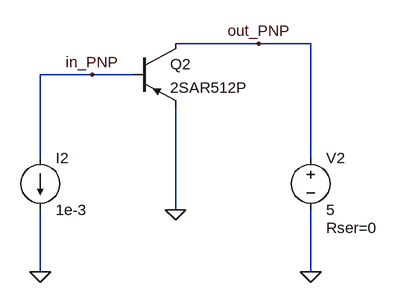
[diagram p0: schematic priklad1.1.asc]
priklad1.1.asc, the LTspice schematic file:
Version 4
SHEET 1 880 680
WIRE 240 -32 112 -32
WIRE 320 -32 240 -32
WIRE -16 16 -96 16
WIRE 48 16 -16 16
WIRE -96 144 -96 16
WIRE 320 144 320 -32
WIRE 112 224 112 64
WIRE -96 320 -96 224
WIRE 320 320 320 224
FLAG -96 320 0
FLAG 112 224 0
FLAG 320 320 0
FLAG -16 16 in_PNP
FLAG 240 -32 out_PNP
SYMBOL current -96 144 R0
WINDOW 123 0 0 Left 2
WINDOW 39 0 0 Left 2
SYMATTR InstName I2
SYMATTR Value 1e-3
SYMBOL pnp 48 -32 R0
SYMATTR InstName Q2
SYMATTR Value 2SAR512P
SYMBOL voltage 320 128 R0
WINDOW 123 0 0 Left 2
WINDOW 39 24 124 Left 2
SYMATTR InstName V2
SYMATTR Value 5
SYMATTR SpiceLine Rser=0

The netlist it stands for:
* priklad1.1.asc
I2 in_PNP 0 1e-3
Q2 out_PNP in_PNP 0 0 2SAR512P
V2 out_PNP 0 5 Rser=0
.model NPN NPN
.model PNP PNP
.lib standard.bjt
.backanno
.end